# Altium project PCB_Project.PrjPcb
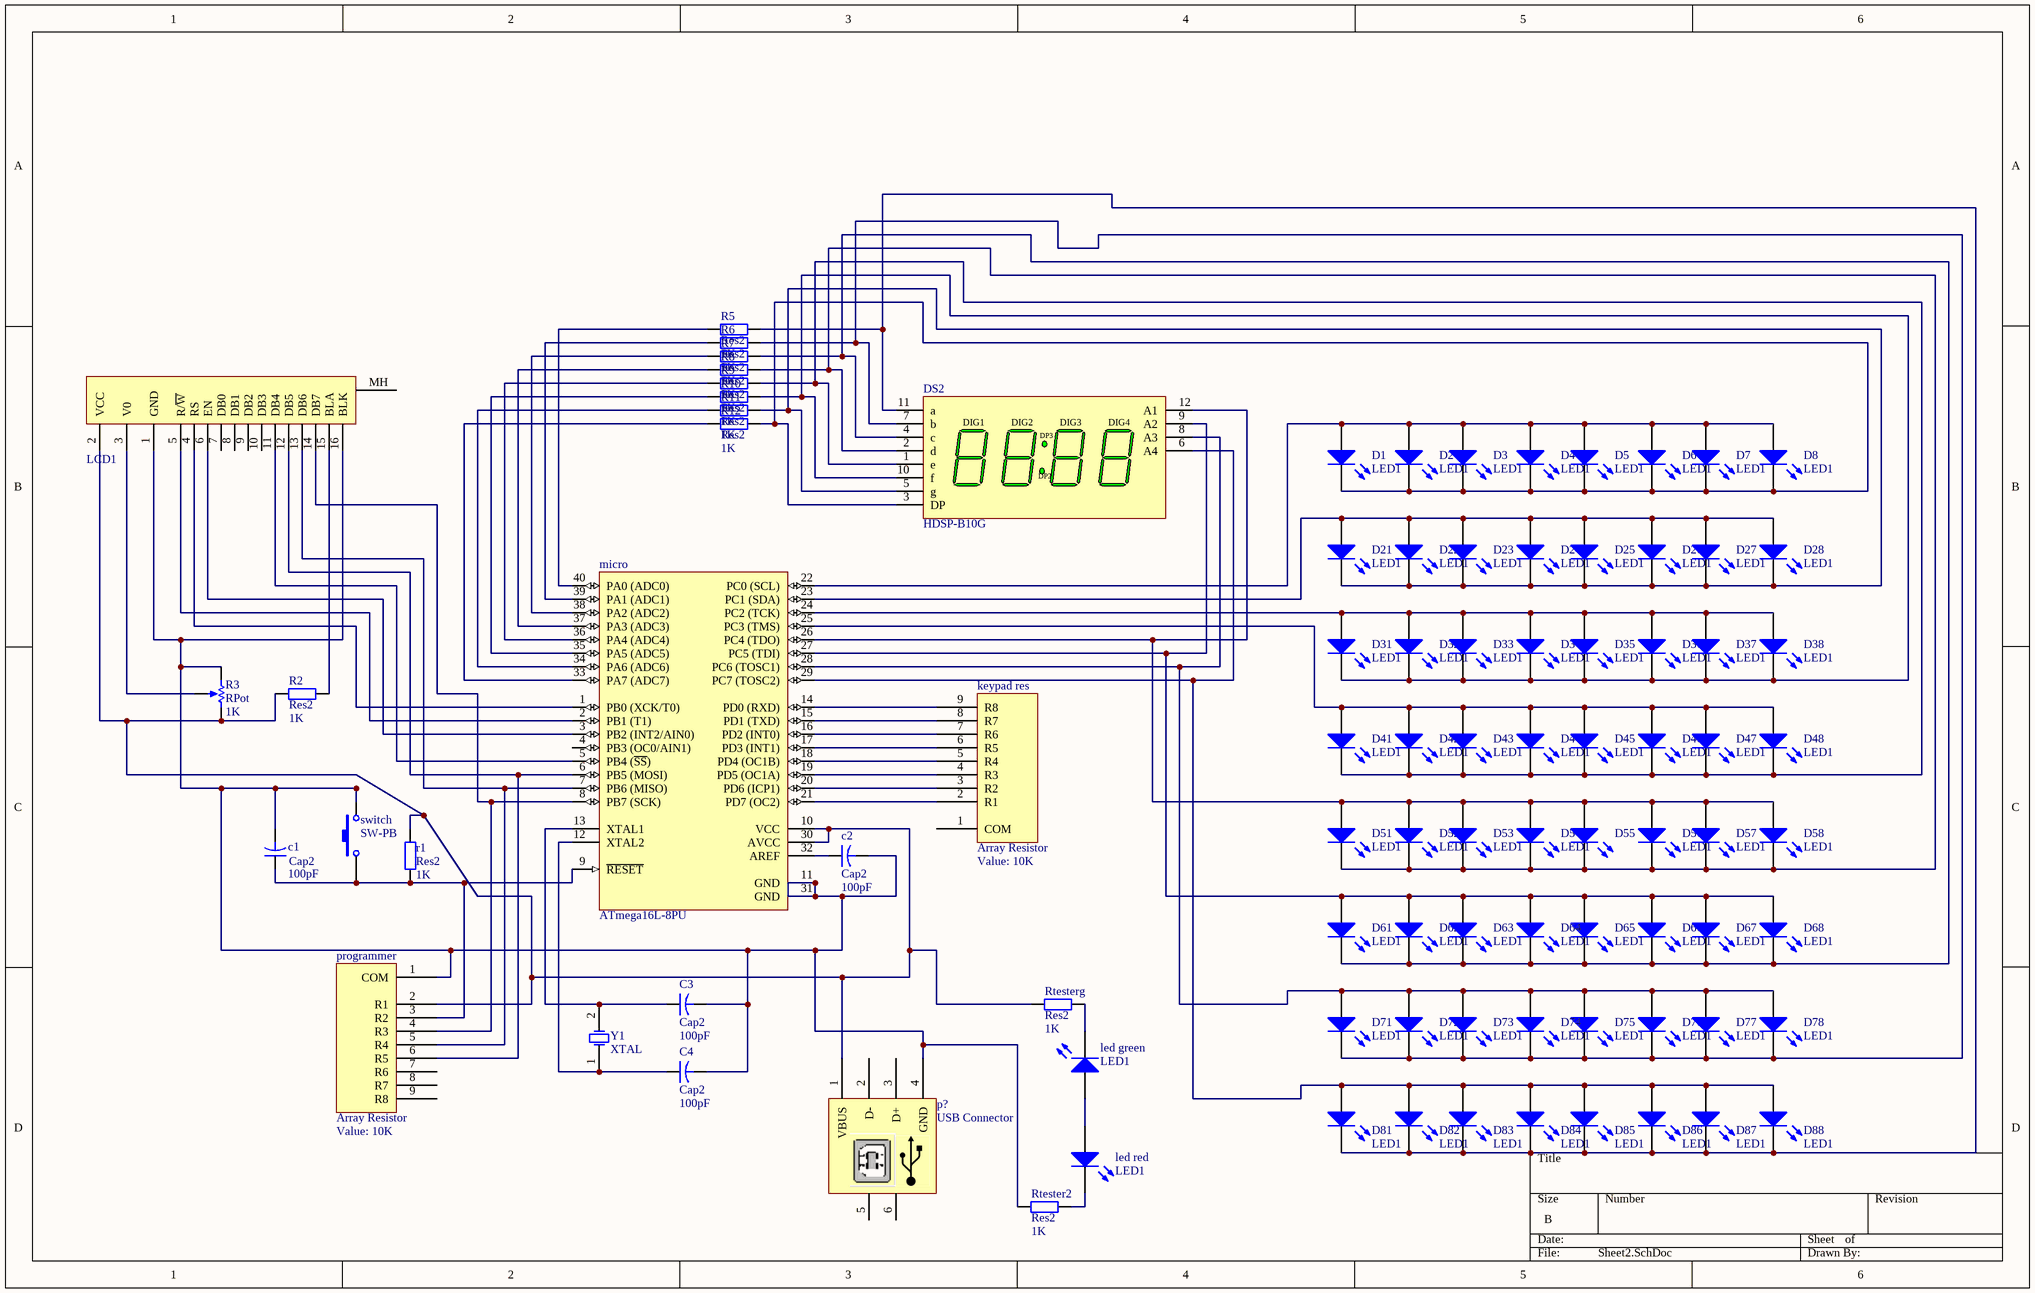
[diagram p0: Sheet2.SchDoc]
1 sheet, 91 parts. Net scope: global (net labels, ports and power ports of the same name join across sheets).
Board file: PCB2.PcbDoc

## Sheet Sheet2.SchDoc
size B; PageSetup: Record=PageOptions|CenterHorizontal=True|CenterVertical=True|PrintScale=1.00|XCorrection=1.00|YCorrection=1.00|PrintKind=1|BorderSize=5000000|LeftOffset=0|BottomOffset=0|Orientation=2|PaperLength=1000|PaperWidth=1000|Scale=100|PaperSource=7|PrintQuality=-3|MediaType=1|DitherType=10|PrintScaleMode=1|PaperKind=B4 (JIS)|PaperIndex=12

### Parts
c1  Cap2  value 100pF  [CAPR5-4X5]
c2  Cap2  value 100pF  [CAPR5-4X5]
C3  Cap2  value 100pF  [CAPR5-4X5]
C4  Cap2  value 100pF  [CAPR5-4X5]
D1  LED1  [LED-1]
D2  LED1  [LED-1]
D3  LED1  [LED-1]
D4  LED1  [LED-1]
D5  LED1  [LED-1]
D6  LED1  [LED-1]
D7  LED1  [LED-1]
D8  LED1  [LED-1]
D21  LED1  [LED-1]
D22  LED1  [LED-1]
D23  LED1  [LED-1]
D24  LED1  [LED-1]
D25  LED1  [LED-1]
D26  LED1  [LED-1]
D27  LED1  [LED-1]
D28  LED1  [LED-1]
D31  LED1  [LED-1]
D32  LED1  [LED-1]
D33  LED1  [LED-1]
D34  LED1  [LED-1]
D35  LED1  [LED-1]
D36  LED1  [LED-1]
D37  LED1  [LED-1]
D38  LED1  [LED-1]
D41  LED1  [LED-1]
D42  LED1  [LED-1]
D43  LED1  [LED-1]
D44  LED1  [LED-1]
D45  LED1  [LED-1]
D46  LED1  [LED-1]
D47  LED1  [LED-1]
D48  LED1  [LED-1]
D51  LED1  [LED-1]
D52  LED1  [LED-1]
D53  LED1  [LED-1]
D54  LED1  [LED-1]
D55  LED1  [LED-1]  (value not drawn)
D56  LED1  [LED-1]
D57  LED1  [LED-1]
D58  LED1  [LED-1]
D61  LED1  [LED-1]
D62  LED1  [LED-1]
D63  LED1  [LED-1]
D64  LED1  [LED-1]
D65  LED1  [LED-1]
D66  LED1  [LED-1]
D67  LED1  [LED-1]
D68  LED1  [LED-1]
D71  LED1  [LED-1]
D72  LED1  [LED-1]
D73  LED1  [LED-1]
D74  LED1  [LED-1]
D75  LED1  [LED-1]
D76  LED1  [LED-1]
D77  LED1  [LED-1]
D78  LED1  [LED-1]
D81  LED1  [LED-1]
D82  LED1  [LED-1]
D83  LED1  [LED-1]
D84  LED1  [LED-1]
D85  LED1  [LED-1]
D86  LED1  [LED-1]
D87  LED1  [LED-1]
D88  LED1  [LED-1]
DS2  HDSP-B10G  [B-88]
keypad_res  Array Resistor  value 10K  [Res Array]
LCD1  20x4  [LCD 20x4]  (value not drawn)
led_green  LED1  [LED-1]
led_red  LED1  [LED-1]
micro  ATmega16L-8PU  [40P6]
programmer  Array Resistor  value 10K  [Res Array]
r1  Res2  value 1K  [AXIAL-0.4]
R2  Res2  value 1K  [AXIAL-0.4]
R3  RPot  value 1K  [VR5]
R5  Res2  value 1K  [AXIAL-0.4]
R6  Res2  value 1K  [AXIAL-0.4]
R7  Res2  value 1K  [AXIAL-0.4]
R8  Res2  value 1K  [AXIAL-0.4]
R9  Res2  value 1K  [AXIAL-0.4]
R10  Res2  value 1K  [AXIAL-0.4]
R11  Res2  value 1K  [AXIAL-0.4]
R12  Res2  value 1K  [AXIAL-0.4]
Rtester2  Res2  value 1K  [AXIAL-0.4]
Rtesterg  Res2  value 1K  [AXIAL-0.4]
switch  SW-PB  [SPST-2]
usb  USB Connector  [USB2.5-2H4E]
Y1  XTAL  [R38]

### Nets
Netc1_1: c1.1 micro.9(~{RESET}) programmer.3(R2) r1.1 switch.1
Netc1_2: c1.2 c2.2 C3.2 C4.2 LCD1.1(GND) LCD1.16(BLK) micro.11(GND) micro.31(GND) programmer.1(COM) R3.1(TOP) Rtester2.1 switch.2 usb.4(GND)
Netc2_1: c2.1 micro.32(AREF)
NetC3_1: C3.1 micro.13(XTAL1) Y1.2(OSC2)
NetC4_1: C4.1 micro.12(XTAL2) Y1.1(OSC1)
NetD1_1: D1.1(A) D2.1(A) D3.1(A) D4.1(A) D5.1(A) D6.1(A) D7.1(A) D8.1(A) micro.22(PC0_(SCL))
NetD1_2: D1.2(K) D2.2(K) D3.2(K) D4.2(K) D5.2(K) D6.2(K) D7.2(K) D8.2(K) DS2.3(DP) R12.2
NetD21_1: D21.1(A) D22.1(A) D23.1(A) D24.1(A) D25.1(A) D26.1(A) D27.1(A) D28.1(A) micro.23(PC1_(SDA))
NetD21_2: D21.2(K) D22.2(K) D23.2(K) D24.2(K) D25.2(K) D26.2(K) D27.2(K) D28.2(K) DS2.5(g) R11.2
NetD31_1: D31.1(A) D32.1(A) D33.1(A) D34.1(A) D35.1(A) D36.1(A) D37.1(A) D38.1(A) micro.24(PC2_(TCK))
NetD31_2: D31.2(K) D32.2(K) D33.2(K) D34.2(K) D35.2(K) D36.2(K) D37.2(K) D38.2(K) DS2.10(f) R10.2
NetD41_1: D41.1(A) D42.1(A) D43.1(A) D44.1(A) D45.1(A) D46.1(A) D47.1(A) D48.1(A) micro.25(PC3_(TMS))
NetD41_2: D41.2(K) D42.2(K) D43.2(K) D44.2(K) D45.2(K) D46.2(K) D47.2(K) D48.2(K) DS2.1(e) R9.2
NetD51_1: D51.1(A) D52.1(A) D53.1(A) D54.1(A) D55.1(A) D56.1(A) D57.1(A) D58.1(A) DS2.12(A1) micro.26(PC4_(TDO))
NetD51_2: D51.2(K) D52.2(K) D53.2(K) D54.2(K) D55.2(K) D56.2(K) D57.2(K) D58.2(K) DS2.2(d) R8.2
NetD61_1: D61.1(A) D62.1(A) D63.1(A) D64.1(A) D65.1(A) D66.1(A) D67.1(A) D68.1(A) DS2.9(A2) micro.27(PC5_(TDI))
NetD61_2: D61.2(K) D62.2(K) D63.2(K) D64.2(K) D65.2(K) D66.2(K) D67.2(K) D68.2(K) DS2.4(c) R7.2
NetD71_1: D71.1(A) D72.1(A) D73.1(A) D74.1(A) D75.1(A) D76.1(A) D77.1(A) D78.1(A) DS2.8(A3) micro.28(PC6_(TOSC1))
NetD71_2: D71.2(K) D72.2(K) D73.2(K) D74.2(K) D75.2(K) D76.2(K) D77.2(K) D78.2(K) DS2.7(b) R6.2
NetD81_1: D81.1(A) D82.1(A) D83.1(A) D84.1(A) D85.1(A) D86.1(A) D87.1(A) D88.1(A) DS2.6(A4) micro.29(PC7_(TOSC2))
NetD81_2: D81.2(K) D82.2(K) D83.2(K) D84.2(K) D85.2(K) D86.2(K) D87.2(K) D88.2(K) DS2.11(a) R5.2
Netkeypad_res_2: keypad_res.2(R1) micro.21(PD7_(OC2))
Netkeypad_res_3: keypad_res.3(R2) micro.20(PD6_(ICP1))
Netkeypad_res_4: keypad_res.4(R3) micro.19(PD5_(OC1A))
Netkeypad_res_5: keypad_res.5(R4) micro.18(PD4_(OC1B))
Netkeypad_res_6: keypad_res.6(R5) micro.17(PD3_(INT1))
Netkeypad_res_7: keypad_res.7(R6) micro.16(PD2_(INT0))
Netkeypad_res_8: keypad_res.8(R7) micro.15(PD1_(TXD))
Netkeypad_res_9: keypad_res.9(R8) micro.14(PD0_(RXD))
NetLCD1_2: LCD1.2(VCC) micro.10(VCC) micro.30(AVCC) programmer.2(R1) r1.2 R2.1 R3.2(BOT) Rtesterg.1 usb.1(VBUS)
NetLCD1_3: LCD1.3(V0) R3.3(TAP)
NetLCD1_4: LCD1.4(RS) micro.1(PB0_(XCK/T0))
NetLCD1_5: LCD1.5(R/~{W}) micro.2(PB1_(T1))
NetLCD1_6: LCD1.6(EN) micro.3(PB2_(INT2/AIN0))
NetLCD1_11: LCD1.11(DB4) micro.5(PB4_(~{SS}))
NetLCD1_12: LCD1.12(DB5) micro.6(PB5_(MOSI)) programmer.6(R5)
NetLCD1_13: LCD1.13(DB6) micro.7(PB6_(MISO)) programmer.5(R4)
NetLCD1_14: LCD1.14(DB7) micro.8(PB7_(SCK)) programmer.4(R3)
NetLCD1_15: LCD1.15(BLA) R2.2
Netled_green_1: led_green.1(A) led_red.1(A)
Netled_green_2: led_green.2(K) Rtesterg.2
Netled_red_2: led_red.2(K) Rtester2.2
Netmicro_33: micro.33(PA7_(ADC7)) R12.1
Netmicro_34: micro.34(PA6_(ADC6)) R11.1
Netmicro_35: micro.35(PA5_(ADC5)) R10.1
Netmicro_36: micro.36(PA4_(ADC4)) R9.1
Netmicro_37: micro.37(PA3_(ADC3)) R8.1
Netmicro_38: micro.38(PA2_(ADC2)) R7.1
Netmicro_39: micro.39(PA1_(ADC1)) R6.1
Netmicro_40: micro.40(PA0_(ADC0)) R5.1

Not connected (* = marked no-connect by the designer): keypad_res 1(COM); LCD1 7(DB0) 8(DB1) 9(DB2) 10(DB3) MH; micro 4(PB3_(OC0/AIN1)); programmer 7(R6) 8(R7) 9(R8); usb 2(D-) 3(D+) 5 6

### Notes on the sheet
- (in symbol HDSP-B10G) DIG1; DIG2; DIG3; DIG4; DP3; DP2

### Library data of the parts
c1 c2 C3 C4 = Cap2: Capacitor; Published: 23-Sep-2002; PackageReference: CAPR5-4X5; Publisher: Altium Limited; PackageDescription: Capacitor; 2 Leads
D1-D8 D21-D28 D31-D38 D41-D48 D51-D58 D61-D68 D71-D78 D81-D88 led_green led_red = LED1: Typical RED GaAs LED; Published: 8-Jun-2000; LatestRevisionDate: 08-Jul-2005; LatestRevisionNote: Mech Layer 1 removed.; PackageReference: LED-1; Publisher: Altium Limited; PackageDescription: LED; 2 Leads
DS2 = HDSP-B10G: 14.22 mm Untinted, 88:88 4-Digit 7-Segment Display: CA, Black Surface; LuminousIntensity: 3200 ucd (Minimum).; LED_Colour: Green; Published: 26-May-2004; LatestRevisionDate: 11-Oct-2004; LatestRevisionNote: Display outline superimposed on PCB Footprint.; DatasheetVersion: 23-Sep-2002; PackageVersion: 21-Aug-2001; PackageReference: B-88; Publisher: Altium Limited; PackageDescription: LED, 7-Segment Display, 14.22 mm, Four Digit, 88:88; 12 Leads; Row Space 15.24 mm; Pitch 2.54 mm; ComponentLink1Description: Manufacturer Link; ComponentLink1URL: http://www.agilent.com/; ComponentLink2Description: Datasheet; ComponentLink2URL: http://cp.literature.agilent.com/litweb/pdf/5988-7859EN.pdf
keypad_res programmer = Res Array: Resistor Pack
LCD1 = LCD: Designer: Saeid Jorablo; Company: My self; Adding Date: 10/21/2009; LCDType: 20x4
micro = ATmega16L-8PU: 8-bit AVR Microcontroller, 2.7-5.5V, 16KB Flash, 512 Bytes EEPROM, 1KB SRAM, 40-pin PDIP, Industrial Grade (-40°C to 85°C), Pb-Free; DatasheetVersion: revS, May-2009; PackageVersion: revB, Sep-2001; PackageReference: 40P6; PackageDescription: 40-lead (0.600"/15.24mm Wide) Plastic Dual Inline Package (PDIP); Code_JEDEC: MS-011-AC; ComponentLink1Description: Manufacturer URL; ComponentLink1URL: http://www.atmel.com/; ComponentLink2Description: ATmega16(L)  Datasheet; ComponentLink2URL: http://www.atmel.com/dyn/resources/prod_documents/doc2466.pdf; ComponentLink3Description: ATmega16(L) Summary; ComponentLink3URL: http://www.atmel.com/dyn/resources/prod_documents/2466S.pdf
r1 R2 R5-R12 Rtester2 Rtesterg = Res2: Resistor; Published: 8-Jun-2000; LatestRevisionDate: 17-Jul-2002; LatestRevisionNote: Re-released for DXP Platform.; PackageReference: AXIAL-0.4; Publisher: Altium Limited; PackageDescription: Axial Device, Thru-Hole; 2 Leads; 0.4 in Pin Spacing
R3 = RPot: Potentiometer; Sim Note: Enter the Resistance value and the set point into parameter fields.; Set Position: 0.5; Published: 8-Jun-2000; LatestRevisionDate: 17-Jul-2002; LatestRevisionNote: Re-released for DXP Platform.; PackageReference: VR5; Publisher: Altium Limited; PackageDescription: Variable Resistor, Thru-Hole; 3 Leads
switch = SW-PB: Switch; Published: 24-Mar-1999; LatestRevisionDate: 17-Jul-2002; LatestRevisionNote: Re-released for DXP Platform.; PackageReference: SPST-2; Publisher: Altium Limited; PackageDescription: Switch; 2 Leads
usb = USB: USB Connector-B Type; Designer: Eng. Saeid Jorablo; Company: DASE Co
Y1 = XTAL: Crystal Oscillator; Published: 8-Jun-2000; LatestRevisionDate: 17-Jul-2002; LatestRevisionNote: Re-released for DXP Platform.; PackageReference: R38; Publisher: Altium Limited; PackageDescription: Crystal, Thru-Hole; 2 Leads; Body 3.1 x 8.2 mm (Dia.xH)